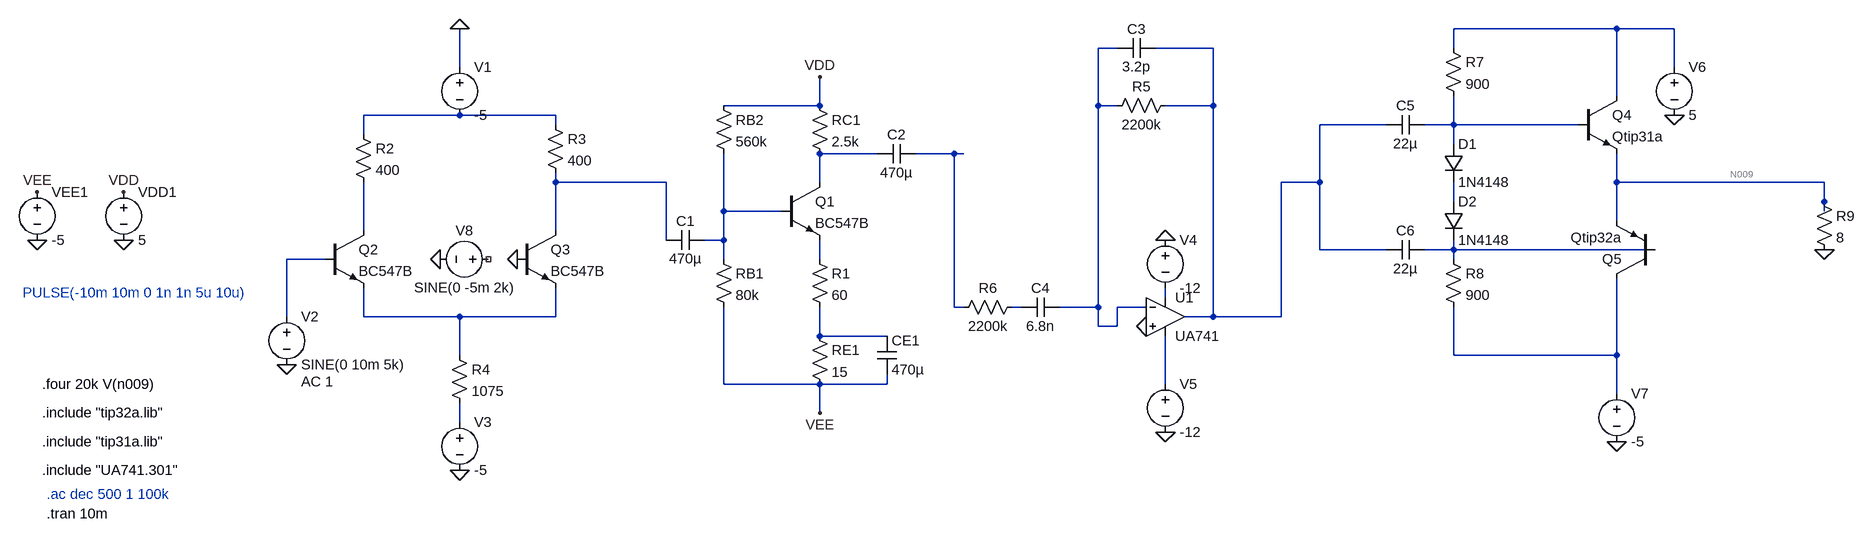
[diagram p0: schematic pre_final.asc]
pre_final.asc, the LTspice schematic file:
Version 4
SHEET 1 1848 688
WIRE 1376 -208 1104 -208
WIRE 1472 -208 1376 -208
WIRE 272 -176 240 -176
WIRE 432 -176 336 -176
WIRE 1104 -176 1104 -208
WIRE -976 -144 -976 -208
WIRE 1472 -144 1472 -208
WIRE 1376 -96 1376 -208
WIRE -224 -80 -224 -128
WIRE -224 -80 -384 -80
WIRE 240 -80 240 -176
WIRE 272 -80 240 -80
WIRE 432 -80 432 -176
WIRE 432 -80 352 -80
WIRE -976 -64 -1136 -64
WIRE -816 -64 -976 -64
WIRE -816 -48 -816 -64
WIRE 992 -48 816 -48
WIRE 1104 -48 1104 -96
WIRE 1104 -48 1056 -48
WIRE 1312 -48 1104 -48
WIRE -1136 -32 -1136 -64
WIRE 1104 -16 1104 -48
WIRE -128 0 -224 0
WIRE 0 0 -64 0
WIRE 16 0 0 0
WIRE -816 48 -816 32
WIRE -480 48 -816 48
WIRE -224 48 -224 0
WIRE 816 48 816 -48
WIRE 816 48 752 48
WIRE 1376 48 1376 0
WIRE 1792 48 1376 48
WIRE 1104 80 1104 48
WIRE 1792 80 1792 48
WIRE -384 96 -384 0
WIRE -288 96 -384 96
WIRE 1792 96 1792 80
WIRE 1376 112 1376 48
WIRE -1136 128 -1136 48
WIRE -816 128 -816 48
WIRE -480 144 -480 48
WIRE -384 144 -384 96
WIRE -384 144 -416 144
WIRE 816 160 816 48
WIRE 992 160 816 160
WIRE 1104 160 1104 144
WIRE 1104 160 1056 160
WIRE 1440 160 1104 160
WIRE -1200 176 -1264 176
WIRE -384 176 -384 144
WIRE -224 176 -224 144
WIRE 1104 176 1104 160
WIRE 352 240 352 224
WIRE 0 256 0 0
WIRE 16 256 0 256
WIRE 112 256 96 256
WIRE 240 256 240 -80
WIRE 240 256 176 256
WIRE 320 256 272 256
WIRE -1264 272 -1264 176
WIRE -1136 272 -1136 224
WIRE -976 272 -1136 272
WIRE -816 272 -816 224
WIRE -816 272 -976 272
WIRE 432 272 432 -80
WIRE 432 272 384 272
WIRE 752 272 752 48
WIRE 752 272 432 272
WIRE 240 288 240 256
WIRE 272 288 272 256
WIRE 272 288 240 288
WIRE -224 304 -224 256
WIRE -112 304 -224 304
WIRE -976 336 -976 272
WIRE 1104 336 1104 256
WIRE 1376 336 1376 208
WIRE 1376 336 1104 336
WIRE -384 384 -384 256
WIRE -224 384 -384 384
WIRE -112 384 -112 368
WIRE -112 384 -224 384
WIRE 352 384 352 304
WIRE 1376 400 1376 336
WIRE -224 432 -224 384
WIRE -976 448 -976 416
FLAG -224 -128 VDD
FLAG -1680 144 0
FLAG -1680 64 VEE
FLAG -224 432 VEE
FLAG -1536 64 VDD
FLAG -1536 144 0
FLAG -976 -208 0
FLAG -1264 352 0
FLAG -976 528 0
FLAG 352 144 0
FLAG 352 464 0
FLAG 1472 -64 0
FLAG 1792 160 0
FLAG 1376 480 0
FLAG 320 288 0
FLAG -1008 176 0
FLAG -880 176 0
DATAFLAG -224 384 ""
DATAFLAG -160 0 ""
DATAFLAG -384 64 ""
DATAFLAG -224 176 ""
DATAFLAG -816 272 ""
DATAFLAG 432 272 ""
DATAFLAG 240 48 ""
DATAFLAG 752 256 ""
DATAFLAG 1472 48 ""
DATAFLAG 1296 336 ""
DATAFLAG 1104 64 ""
DATAFLAG 1104 -64 ""
DATAFLAG 1136 160 ""
SYMBOL npn -288 48 R0
SYMATTR InstName Q1
SYMATTR Value BC547B
SYMBOL res -240 288 R0
SYMATTR InstName RE1
SYMATTR Value 15
SYMBOL cap -128 304 R0
SYMATTR InstName CE1
SYMATTR Value 470µ
SYMBOL res -400 160 R0
SYMATTR InstName RB1
SYMATTR Value 80k
SYMBOL cap -416 128 R90
WINDOW 0 0 32 VBottom 2
WINDOW 3 32 32 VTop 2
SYMATTR InstName C1
SYMATTR Value 470µ
SYMBOL res -400 -96 R0
SYMATTR InstName RB2
SYMATTR Value 560k
SYMBOL res -240 -96 R0
SYMATTR InstName RC1
SYMATTR Value 2.5k
SYMBOL cap -64 -16 R90
WINDOW 0 0 32 VBottom 2
WINDOW 3 32 32 VTop 2
SYMATTR InstName C2
SYMATTR Value 470µ
SYMBOL voltage -1680 48 R0
WINDOW 123 0 0 Left 0
WINDOW 39 0 0 Left 0
SYMATTR InstName VEE1
SYMATTR Value -5
SYMBOL voltage -1536 48 R0
WINDOW 123 0 0 Left 0
WINDOW 39 0 0 Left 0
SYMATTR InstName VDD1
SYMATTR Value 5
SYMBOL res -240 160 R0
SYMATTR InstName R1
SYMATTR Value 60
SYMBOL voltage -976 -160 R0
WINDOW 123 0 0 Left 0
WINDOW 39 0 0 Left 0
SYMATTR InstName V1
SYMATTR Value -5
SYMBOL res -1152 -48 R0
SYMATTR InstName R2
SYMATTR Value 400
SYMBOL res -832 -64 R0
SYMATTR InstName R3
SYMATTR Value 400
SYMBOL npn -1200 128 R0
SYMATTR InstName Q2
SYMATTR Value BC547B
SYMBOL npn -880 128 R0
SYMATTR InstName Q3
SYMATTR Value BC547B
SYMBOL voltage -1264 256 R0
WINDOW 123 24 124 Left 2
WINDOW 39 0 0 Left 0
SYMATTR Value2 AC 1
SYMATTR InstName V2
SYMATTR Value SINE(0 10m 5k)
SYMBOL res -992 320 R0
SYMATTR InstName R4
SYMATTR Value 1075
SYMBOL voltage -976 432 R0
WINDOW 123 0 0 Left 0
WINDOW 39 0 0 Left 0
SYMATTR InstName V3
SYMATTR Value -5
SYMBOL cap 336 -192 R90
WINDOW 0 0 32 VBottom 2
WINDOW 3 32 32 VTop 2
SYMATTR InstName C3
SYMATTR Value 3.2p
SYMBOL res 368 -96 R90
WINDOW 0 0 56 VBottom 2
WINDOW 3 32 56 VTop 2
SYMATTR InstName R5
SYMATTR Value 2200k
SYMBOL res 112 240 R90
WINDOW 0 0 56 VBottom 2
WINDOW 3 32 56 VTop 2
SYMATTR InstName R6
SYMATTR Value 2200k
SYMBOL cap 176 240 R90
WINDOW 0 0 32 VBottom 2
WINDOW 3 32 32 VTop 2
SYMATTR InstName C4
SYMATTR Value 6.8n
SYMBOL voltage 352 128 R0
WINDOW 123 0 0 Left 0
WINDOW 39 0 0 Left 0
SYMATTR InstName V4
SYMATTR Value -12
SYMBOL voltage 352 368 R0
WINDOW 123 0 0 Left 0
WINDOW 39 0 0 Left 0
SYMATTR InstName V5
SYMATTR Value -12
SYMBOL res 1088 -192 R0
SYMATTR InstName R7
SYMATTR Value 900
SYMBOL npn 1312 -96 R0
SYMATTR InstName Q4
SYMATTR Value Qtip31a
SYMBOL res 1088 160 R0
SYMATTR InstName R8
SYMATTR Value 900
SYMBOL cap 1056 -64 R90
WINDOW 0 0 32 VBottom 2
WINDOW 3 32 32 VTop 2
SYMATTR InstName C5
SYMATTR Value 22µ
SYMBOL cap 1056 144 R90
WINDOW 0 0 32 VBottom 2
WINDOW 3 32 32 VTop 2
SYMATTR InstName C6
SYMATTR Value 22µ
SYMBOL voltage 1472 -160 R0
WINDOW 123 0 0 Left 0
WINDOW 39 0 0 Left 0
SYMATTR InstName V6
SYMATTR Value 5
SYMBOL res 1776 64 R0
SYMATTR InstName R9
SYMATTR Value 8
SYMBOL voltage 1376 384 R0
WINDOW 123 0 0 Left 0
WINDOW 39 0 0 Left 0
SYMATTR InstName V7
SYMATTR Value -5
SYMBOL diode 1088 -16 R0
SYMATTR InstName D1
SYMATTR Value 1N4148
SYMBOL diode 1088 80 R0
SYMATTR InstName D2
SYMATTR Value 1N4148
SYMBOL pnp 1440 208 R180
SYMATTR InstName Q5
SYMATTR Value Qtip32a
SYMBOL OpAmps\\opamp2 352 208 R0
SYMATTR InstName U1
SYMATTR Value UA741
SYMBOL voltage -912 176 R90
WINDOW 0 -32 56 VBottom 2
WINDOW 3 32 56 VTop 2
WINDOW 123 0 0 Left 0
WINDOW 39 0 0 Left 0
SYMATTR InstName V8
SYMATTR Value SINE(0 -5m 2k)
TEXT -1672 528 Left 2 !.include "UA741.301"
TEXT -1672 480 Left 2 !.include "tip31a.lib"
TEXT -1672 432 Left 2 !.include "tip32a.lib"
TEXT -1664 568 Left 2 ;.ac dec 500 1 100k
TEXT -1664 600 Left 2 !.tran 10m
TEXT -1672 384 Left 2 !.four 20k V(n009)
TEXT -1704 232 Left 2 ;PULSE(-10m 10m 0 1n 1n 5u 10u)

The netlist it stands for:
* pre_final.asc
Q1 N006 N011 N015 0 BC547B
RE1 N019 VEE 15
CE1 N019 VEE 470µ
RB1 N011 VEE 80k
C1 N011 N008 470µ
RB2 VDD N011 560k
RC1 VDD N006 2.5k
C2 N007 N006 470µ
VEE1 VEE 0 -5
VDD1 VDD 0 5
R1 N015 N019 60
V1 0 N004 -5
R2 N004 N012 400
R3 N004 N008 400
Q2 N012 N014 N018 0 BC547B
Q3 N008 0 N018 0 BC547B
V2 N014 0 SINE(0 10m 5k) AC 1
R4 N018 N022 1075
V3 N022 0 -5
C3 N003 N002 3.2p
R5 N003 N002 2200k
R6 N017 N007 2200k
C4 N002 N017 6.8n
V4 0 N016 -12
V5 N021 0 -12
R7 N001 N005 900
Q4 N001 N005 N009 0 Qtip31a
R8 N013 N020 900
C5 N005 N003 22µ
C6 N013 N003 22µ
V6 N001 0 5
R9 N009 0 8
V7 N020 0 -5
D1 N005 N010 1N4148
D2 N010 N013 1N4148
Q5 N020 N013 N009 0 Qtip32a
XU1 0 N002 N016 N021 N003 UA741  ; pins In+ In- V+ V- OUT
V8 NC_01 0 SINE(0 -5m 2k)
.model D D
.lib standard.dio
.model NPN NPN
.model PNP PNP
.lib standard.bjt
.include "UA741.301"
.include "tip31a.lib"
.include "tip32a.lib"
* .ac dec 500 1 100k
.tran 10m
.four 20k V(n009)
* PULSE(-10m 10m 0 1n 1n 5u 10u)
.backanno
.end